# Altium schematic sheet input1.SchDoc
size A4
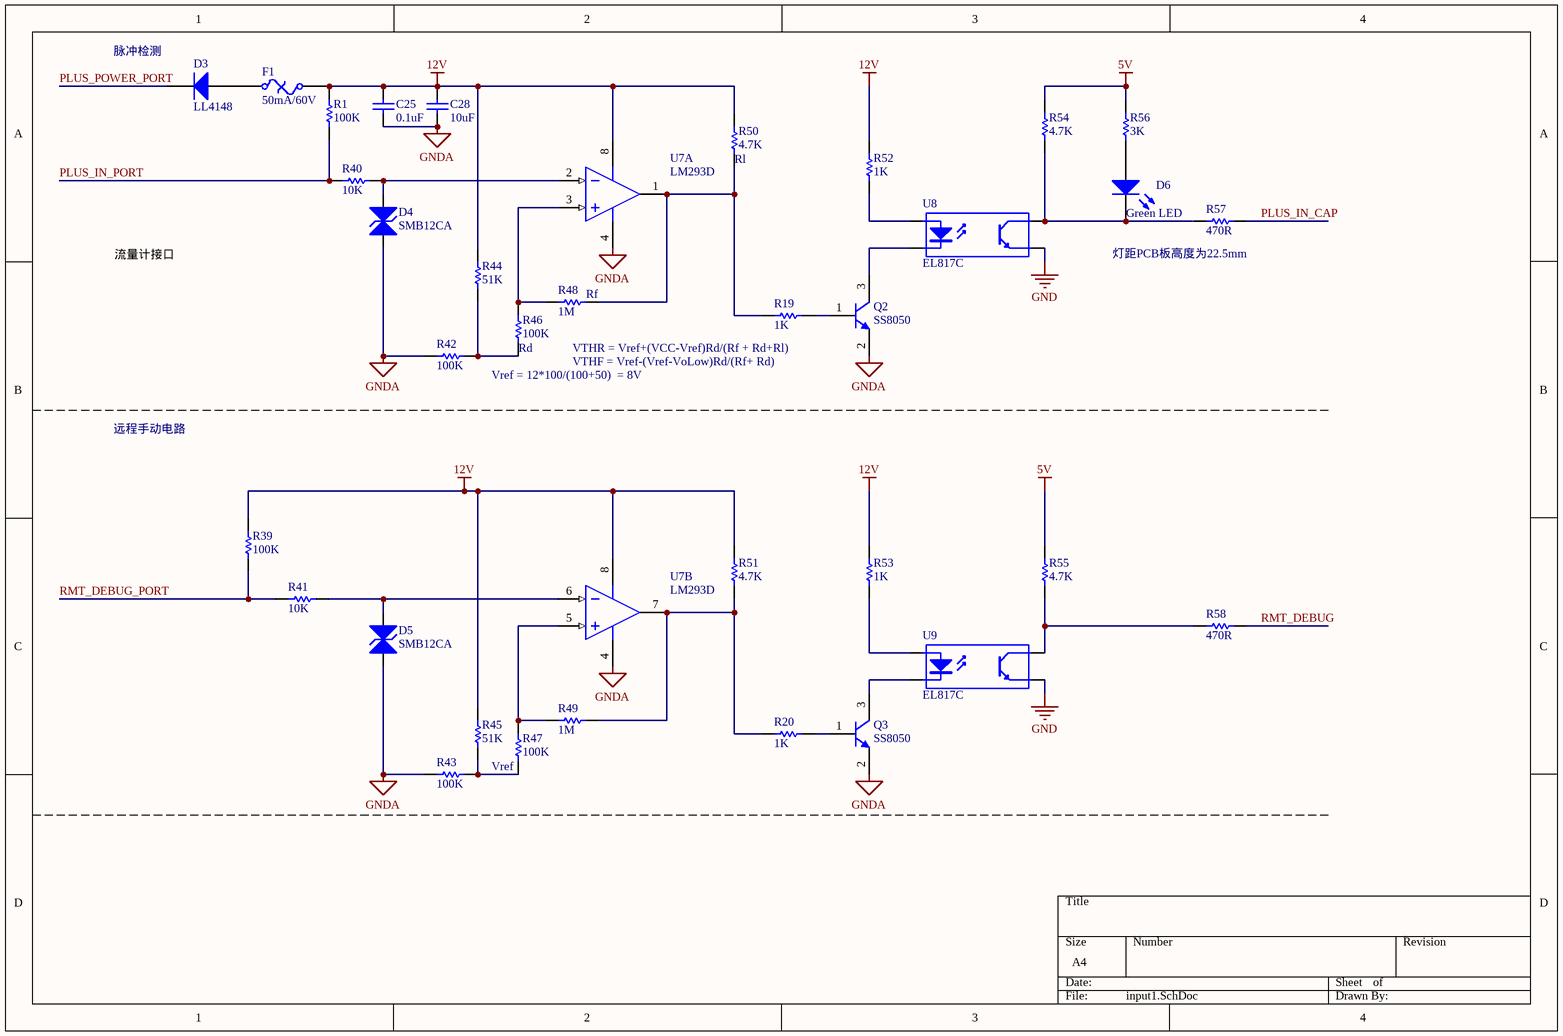
[diagram p0: input1.SchDoc]

## Parts
C25  0.1uF  [CAPC2012M]
C28  10uF  [CAPC2012M]
D3  LL4148  [CD3216-1206]
D4  SMB12CA  [SMB]
D5  SMB12CA  [SMB]
D6  Green LED  [LED254A]
F1  50mA/60V  [RESC3216M]
Q2  SS8050  [SOT-23_N]
Q3  SS8050  [SOT-23_N]
R1  100K  [RESC2012M]
R19  1K  [RESC2012M]
R20  1K  [RESC2012M]
R39  100K  [RESC2012M]
R40  10K  [RESC2012M]
R41  10K  [RESC2012M]
R42  100K  [RESC2012M]
R43  100K  [RESC2012M]
R44  51K  [RESC2012M]
R45  51K  [RESC2012M]
R46  100K  [RESC2012M]
R47  100K  [RESC2012M]
R48  1M  [RESC2012M]
R49  1M  [RESC2012M]
R50  4.7K  [RESC2012M]
R51  4.7K  [RESC2012M]
R52  1K  [RESC2012M]
R53  1K  [RESC2012M]
R54  4.7K  [RESC2012M]
R55  4.7K  [RESC2012M]
R56  3K  [RESC2012M]
R57  470R  [RESC2012M]
R58  470R  [RESC2012M]
U7  LM293D  [SO8_N]  (parts A,B of 2)
U8  EL817C  [SO-4LA]
U9  EL817C  [SO-4LA]

## Nets
5V: R54.2 R55.2 R56.1
12V: C25.2 C28.2 F1.2 R1.2 R39.2 R44.2 R45.2 R50.1 R51.2 R52.1 R53.1 U7.8(V+)
GND: U8.3(E) U9.3(E)
GNDA: C25.1 C28.1 D4.1(A) D5.1(A) Q2.2(E) Q3.2(E) R42.1 R43.1 U7.4(V-)
PLUS_IN_CAP: R57.2
PLUS_IN_PORT: R1.1 R40.2
PLUS_POWER_PORT: D3.2(K)
RMT_DEBUG: R58.2
RMT_DEBUG_PORT: R39.1 R41.2
NetD3_1: D3.1(A) F1.1
NetD4_2: D4.2(K) R40.1 U7.2(IN-)
NetD5_2: D5.2(K) R41.1 U7.6(IN-)
NetD6_1: D6.1(A) R56.2
NetD6_2: D6.2(K) R54.1 R57.1 U8.4(C)
NetQ2_1: Q2.1(B) R19.2
NetQ2_3: Q2.3(C) U8.2(K)
NetQ3_1: Q3.1(B) R20.2
NetQ3_3: Q3.3(C) U9.2(K)
NetR19_1: R19.1 R48.1 R50.2 U7.1(OUT)
NetR20_1: R20.1 R49.2 R51.1 U7.7(OUT)
NetR42_2: R42.2 R44.1 R46.1
NetR43_2: R43.2 R45.1 R47.1
NetR46_2: R46.2 R48.2 U7.3(IN+)
NetR47_2: R47.2 R49.1 U7.5(IN+)
NetR52_2: R52.2 U8.1(A)
NetR53_2: R53.2 U9.1(A)
NetR55_1: R55.1 R58.1 U9.4(C)

## Notes on the sheet
- 脉冲检测
- (near R50) Rl
- 流量计接口
- (near R48) Rf
- (near R57) 灯距PCB板高度为22.5mm
- Vref = 12*100/(100+50)  = 8V
- (near R46) Rd
- VTHR = Vref+(VCC-Vref)Rd/(Rf + Rd+Rl)
- VTHF = Vref-(Vref-VoLow)Rd/(Rf+ Rd)
- 远程手动电路
- (near R47) Vref

## Library data of the parts
C25 C28 = Cap: Capacitor; Value: 1nF; Published: 8-Jun-2000; LatestRevisionDate: 17-Jul-2002; LatestRevisionNote: Re-released for DXP Platform.; PackageReference: RAD-0.3; Publisher: Altium Limited
D3 = Diode 1N4007: 1 Amp General Purpose Rectifier; Published: 8-Jun-2000; LatestRevisionDate: 17-Jul-2002; LatestRevisionNote: Re-released for DXP Platform.; DatasheetVersion: 1998; PackageVersion: Aug-1999; PackageReference: DO-41; Publisher: Altium Limited; Code_JEDEC: DO-204-AL; ComponentLink1Description: Manufacturer Link; ComponentLink1URL: http://www.fairchildsemi.com/; ComponentLink2Description: Datasheet; ComponentLink2URL: http://www.fairchildsemi.com/ds/1N%2F1N4001.pdf
D4 D5 = Bi-dir TVS Diode: Published: 8-Jun-2000; LatestRevisionDate: 17-Jul-2002; LatestRevisionNote: Re-released for DXP Platform.; PackageReference: DIODE-0.7; Publisher: Altium Limited
D6 = LED1: Green LED ,SIP, Dia =3mm; Published: 8-Jun-2000; LatestRevisionDate: 08-Jul-2005; LatestRevisionNote: Mech Layer 1 removed.; PackageReference: LED-1; Publisher: Altium Limited
F1 = Fuse Thermal: Thermal Fuse; Published: 24-Mar-1999; LatestRevisionDate: 17-Jul-2002; LatestRevisionNote: Re-released for DXP Platform.; PackageReference: PIN-W2/E2.8; Publisher: Altium Limited; PackageDescription: Thru-Hole; 2 Leads
Q2 Q3 = PMMT491A: NPN BISS Transistor; Published: 17-Sep-2003; LatestRevisionDate: 12-Dec-2006; LatestRevisionNote: IPC-7351 Footprint Added.; DatasheetVersion: 11-Jun-2001; PackageVersion: May-1999; PackageReference: SOT23; Publisher: Altium Limited; PackageDescription: 3-Pin SOT-23 Package 0.95 mm Pitch, 2.3 mm Lead Span; ComponentLink1Description: Manufacturer Link; ComponentLink1URL: http://www.semiconductors.philips.com/; ComponentLink2Description: Datasheet; ComponentLink2URL: http://www.semiconductors.philips.com/acrobat/datasheets/PMMT491A_5.pdf
R1 R19 R20 R39 R42-R57 = Res1: Resistor; Value: 10K; Published: 8-Jun-2000; LatestRevisionDate: 17-Jul-2002; LatestRevisionNote: Re-released for DXP Platform.; PackageReference: AXIAL-0.3; Publisher: Altium Limited
R40 R41 = Res1: Resistor; Published: 8-Jun-2000; LatestRevisionDate: 17-Jul-2002; LatestRevisionNote: Re-released for DXP Platform.; PackageReference: AXIAL-0.3; Publisher: Altium Limited; Value: 10K
R58 = Res1: Resistor; Value: 470; Published: 8-Jun-2000; LatestRevisionDate: 17-Jul-2002; LatestRevisionNote: Re-released for DXP Platform.; PackageReference: AXIAL-0.3; Publisher: Altium Limited
U7 = LM393AD: Low-Power Dual Voltage Comparator; Published: 24-Aug-2001; LatestRevisionDate: 13-Apr-2006; LatestRevisionNote: IPC-7351 Footprint Added.; DatasheetVersion: Nov-1992; PackageVersion: Dec-2002; PackageReference: SO8; Publisher: Altium Limited; PackageDescription: 8-Pin Small Outline Integrated Circuit 1.27 mm Pitch; Code_JEDEC: MS-012-AA; Code_IPC: SOIC127P600-8; ComponentLink1Description: Manufacturer Link; ComponentLink1URL: http://www.st.com/; ComponentLink2Description: Datasheet; ComponentLink2URL: http://www.st.com/stonline/products/literature/ds/2164/lm193.pdf
U8 U9 = Optoisolator1: 4-Pin Phototransistor Optocoupler; Published: 24-Mar-1999; LatestRevisionDate: 04-Mar-2005; LatestRevisionNote: Sch pins 3 & 4 Swapped.; DatasheetVersion: Nov-2003; PackageReference: DIP-4; Publisher: Altium Limited